# EAGLE design BOARD1A (EAGLE 7.4.0)
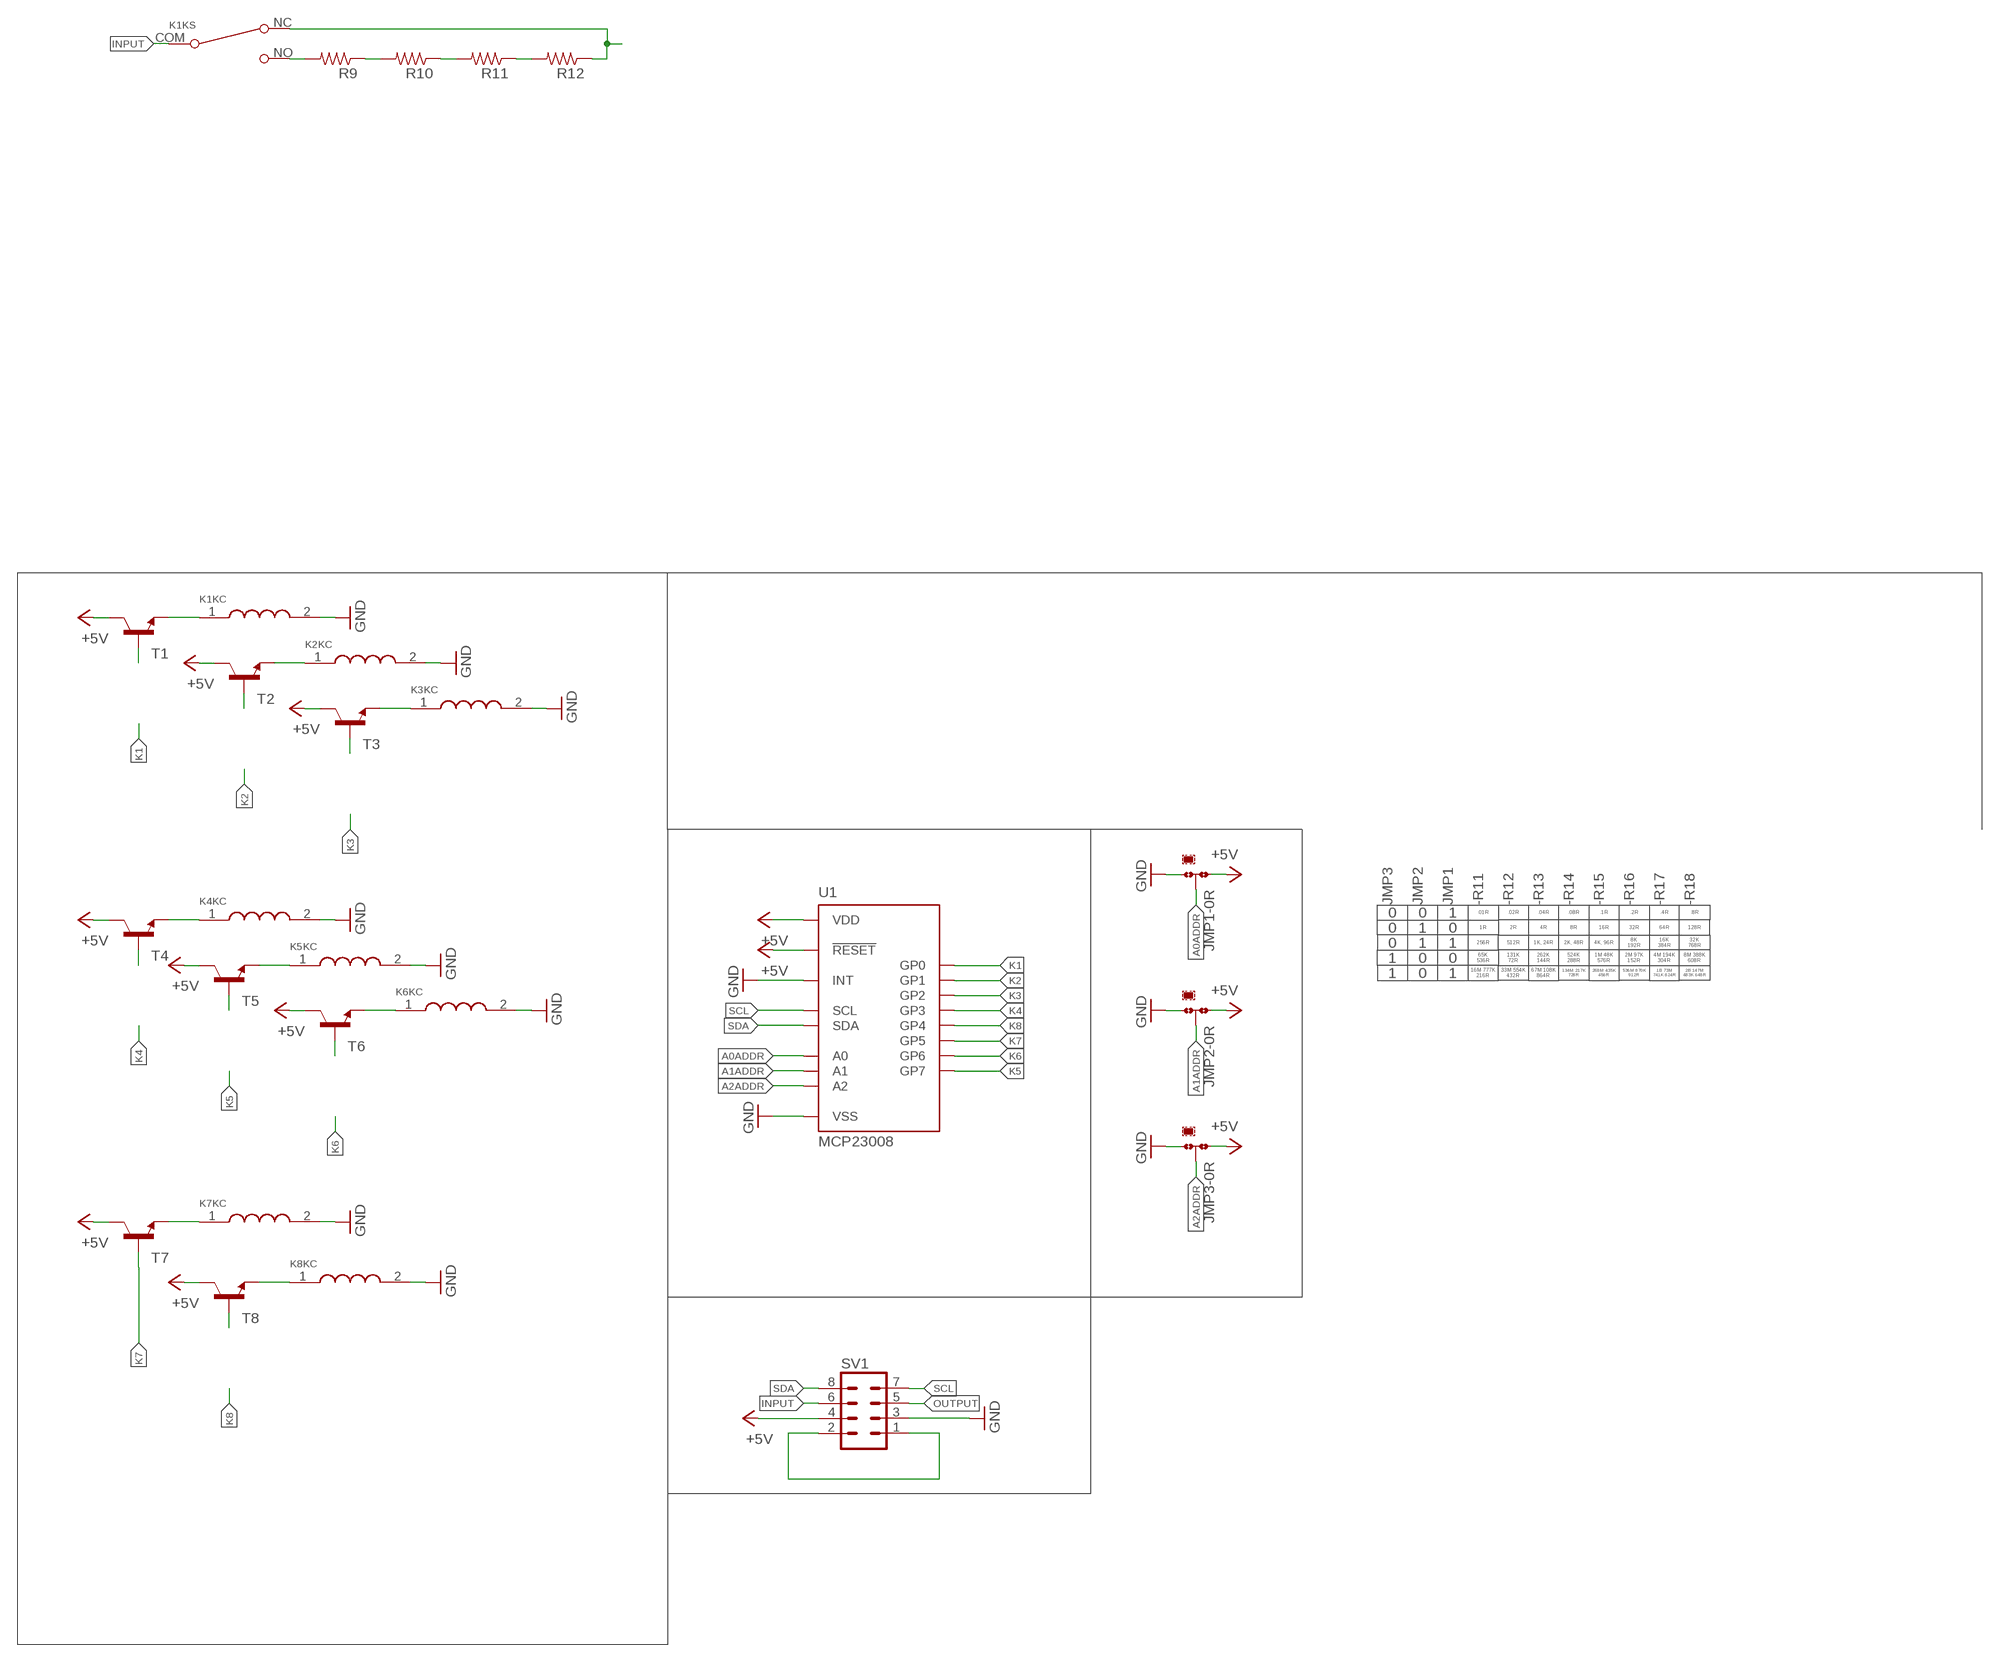
[diagram p0: schematic, sheet 1]

## Parts
JMP1  0R-JUMPA  [A0R-JMP]
JMP2  0R-JUMPA  [A0R-JMP]
JMP3  0R-JUMPA  [A0R-JMP]
K1  G5LE-1-VD DC12  G5LE  [G5LE]
K2  G5LE  [G5LE]
K3  G5LE  [G5LE]
K4  G5LE  [G5LE]
K5  G5LE  [G5LE]
K6  G5LE  [G5LE]
K7  G5LE  [G5LE]
K8  G5LE  [G5LE]
R9  R-US_0207/12  [0207/12]
R10  R-US_0207/12  [0207/12]
R11  R-US_0207/12  [0207/12]
R12  R-US_0207/12  [0207/12]
SV1  MA04-2  [MA04-2]
T1  MMUN2211LT1-NPN-SC59-BEC  [SC59-BEC]
T2  MMUN2211LT1-NPN-SC59-BEC  [SC59-BEC]
T3  MMUN2211LT1-NPN-SC59-BEC  [SC59-BEC]
T4  MMUN2211LT1-NPN-SC59-BEC  [SC59-BEC]
T5  MMUN2211LT1-NPN-SC59-BEC  [SC59-BEC]
T6  MMUN2211LT1-NPN-SC59-BEC  [SC59-BEC]
T7  MMUN2211LT1-NPN-SC59-BEC  [SC59-BEC]
T8  MMUN2211LT1-NPN-SC59-BEC  [SC59-BEC]
U1  MCP23008  [SOIC]

## Nets
+5V: JMP1.1 JMP2.1 JMP3.1 SV1.4 T1.C T2.C T3.C T4.C T5.C T6.C T7.C T8.C U1.P$6(!RESET) U1.P$18(VDD)
A0ADDR: JMP1.2 U1.P$5(A0)
A1ADDR: JMP2.2 U1.P$4(A1)
A2ADDR: JMP3.2 U1.P$3(A2)
GND: JMP1.3 JMP2.3 JMP3.3 K1.2(KC:COILB) K2.2(KC:COILB) K3.2(KC:COILB) K4.2(KC:COILB) K5.2(KC:COILB) K6.2(KC:COILB) K7.2(KC:COILB) K8.2(KC:COILB) SV1.3 U1.P$8(INT) U1.P$9(VSS)
INPUT: K1.COM(KS:P$COM) SV1.6
K1: U1.P$10(GP0)
K2: U1.P$11(GP1)
K3: U1.P$12(GP2)
K4: U1.P$13(GP3)
K5: U1.P$17(GP7)
K6: U1.P$16(GP6)
K7: U1.P$15(GP5)
K8: U1.P$14(GP4)
N$1: K1.NO(KS:P$NO) R9.2
N$2: R9.1 R10.2
N$3: R10.1 R11.2
N$4: R11.1 R12.2
N$5: SV1.1 SV1.2
N$6: K1.NC(KS:P$NC) R12.1
N$11: K1.1(KC:COILA) T1.E
N$12: T1.B
N$13: K2.1(KC:COILA) T2.E
N$14: T2.B
N$15: K3.1(KC:COILA) T3.E
N$16: T3.B
N$17: K4.1(KC:COILA) T4.E
N$18: T4.B
N$19: K5.1(KC:COILA) T5.E
N$20: T5.B
N$21: K6.1(KC:COILA) T6.E
N$22: T6.B
N$23: K7.1(KC:COILA) T7.E
N$24: T7.B
N$25: K8.1(KC:COILA) T8.E
N$26: T8.B
OUTPUT: SV1.5
SCL: SV1.7 U1.P$1(SCL)
SDA: SV1.8 U1.P$2(SDA)
Unconnected: K2.COM(KS:P$COM) K2.NC(KS:P$NC) K2.NO(KS:P$NO) K3.COM(KS:P$COM) K3.NC(KS:P$NC) K3.NO(KS:P$NO) K4.COM(KS:P$COM) K4.NC(KS:P$NC) K4.NO(KS:P$NO) K5.COM(KS:P$COM) K5.NC(KS:P$NC) K5.NO(KS:P$NO) K6.COM(KS:P$COM) K6.NC(KS:P$NC) K6.NO(KS:P$NO) K7.COM(KS:P$COM) K7.NC(KS:P$NC) K7.NO(KS:P$NO) K8.COM(KS:P$COM) K8.NC(KS:P$NC) K8.NO(KS:P$NO)

## Notes on the sheet
- JMP3 | JMP2 | JMP1 | -R11 | -R12 | -R13 | -R14 | -R15 | -R16 | -R17 | -R18
- 0 | 0 | 1 | .01R | .02R | .04R | .08R | .1R | .2R | .4R | .8R
- 0 | 1 | 0 | 1R | 2R | 4R | 8R | 16R | 32R | 64R | 128R
- 0 | 1 | 1 | 256R | 512R | 1K, 24R | 2K, 48R | 4K, 96R
- 8K
  192R
- 16K
  384R
- 32K
  768R
- 1 | 0 | 0
- 65K
  536R
- 131K
  72R
- 262K
  144R
- 524K
  288R
- 1M 48K
  576R
- 2M 97K
  152R
- 4M 194K
  304R
- 8M 388K
  608R
- 1 | 0 | 1
- 16M 777K
  216R
- 33M 554K
  432R
- 67M 108K
  864R
- 134M 217K
  728R
- 268M 435K
  456R
- 536M 870K
  912R
- 1B 73M
  741K 824R
- 2B 147M
  483K 648R

## Library data of the parts
JMP1-JMP3 = jump-0r-smd:0R-JUMP: SMD 0R 0805 Jumper
K1-K8 = Jeremy:G5LE; G5LE: -1
R9-R12 = resistor:R-US_: RESISTOR, American symbol
SV1 = con-lstb:MA04-2: PIN HEADER; OC_FARNELL: unknown; OC_NEWARK: unknown
T1-T8 = transistor-neu-to92:*-NPN-: NPN Transistror
U1 = Jeremy:MCP23008: MCP23008 8-Bit I/O Expander I2C Interface ADDR: S0100XXX

## Net classes
0 default: clearance 0.205 mm

## Board
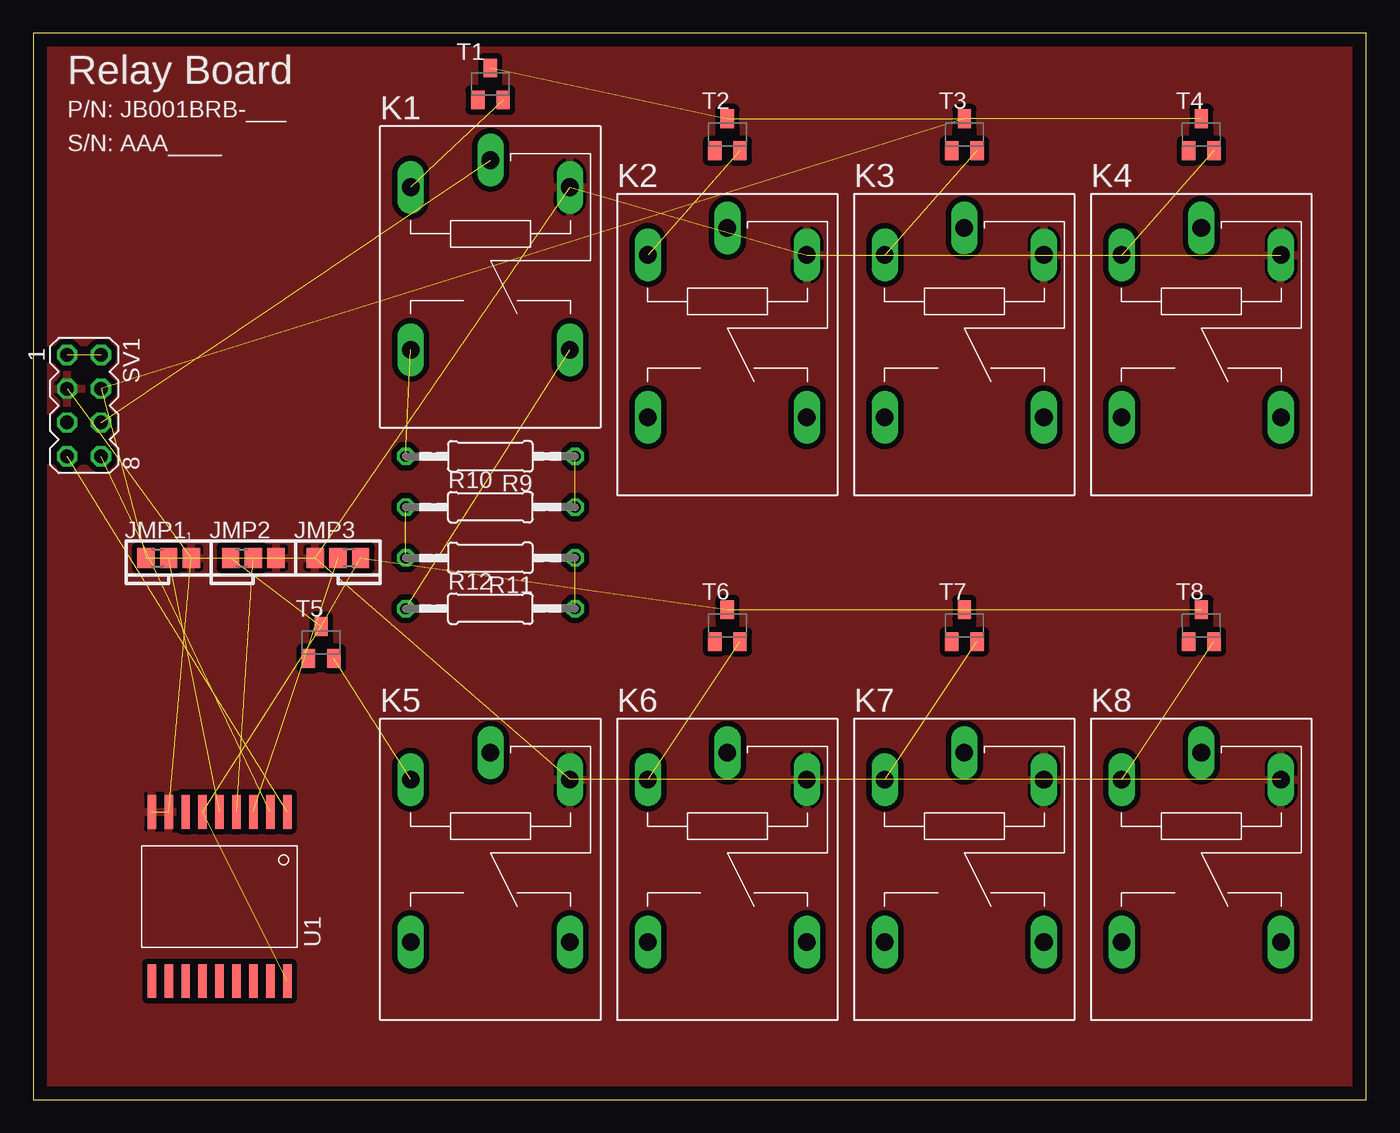
[diagram p1: board, top side]
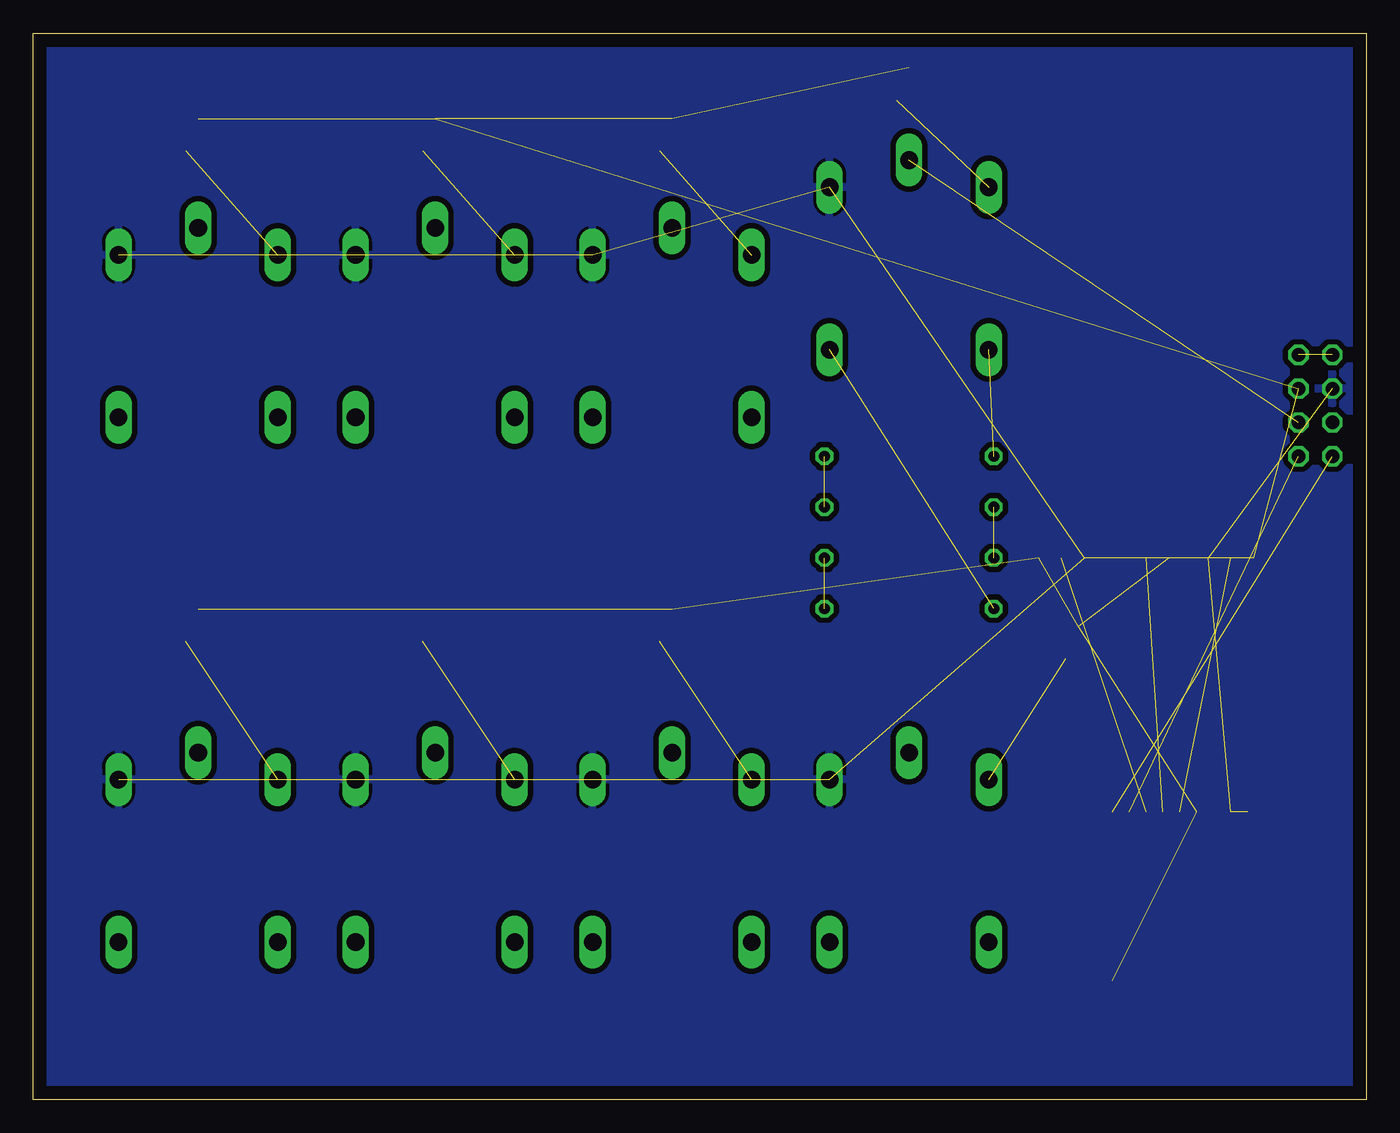
[diagram p2: board, bottom side, seen from below]

Size 100 x 80 mm. Coordinates in mm from the lower left corner, seen from the top.
Outline: 0,0 100,0 100,80 0,80 0,0
Copper layers (1*16): Top 0.035mm / dielectric 1.5mm / Bottom 0.035mm
Design rules "default": minimum track width 10mil, minimum drill 24mil, track to track 8mil, track to pad 8mil, pad to pad 8mil, via to via 8mil, smd to smd 8mil, copper to edge 40mil, drill to drill 8mil, minimum pad ring 10mil, minimum via ring 8mil, stop-mask expansion 4mil, vias tented up to drill 0mil, thermal gap 10mil

### Footprints (pad centres in the part's own frame; a part is rotated, then mirrored left to right if it is on the bottom)
A0R-JMP = smd 1.5 x 1.3: 1 0,1.7; 2 0,0; 3 0,-1.7
G5LE = drill 1.321 long: 1 -7.493,-5.969; 2 -7.493,5.969; COM -9.525,0; NC 4.699,5.969; NO 4.699,-5.969
0207/12 = drill 0.813 octagon: 1 -6.35,0; 2 6.35,0
MA04-2 = drill 1.016 octagon: 1 -3.81,-1.27; 2 -3.81,1.27; 3 -1.27,-1.27; 4 -1.27,1.27; 5 1.27,-1.27; 6 1.27,1.27; 7 3.81,-1.27; 8 3.81,1.27
SC59-BEC = smd 1 x 1.4: B -0.95,-1.2; C 0,1.2; E 0.95,-1.2
SOIC = smd 2.54 x 0.635: P$1 6.35,-5.08; P$2 6.35,-3.81; P$3 6.35,-2.54; P$4 6.35,-1.27; P$5 6.35,0; P$6 6.35,1.27; P$7 6.35,2.54; P$8 6.35,3.81; P$9 6.35,5.08; P$10 -6.35,5.08; P$11 -6.35,3.81; P$12 -6.35,2.54; P$13 -6.35,1.27; P$14 -6.35,0; P$15 -6.35,-1.27; P$16 -6.35,-2.54; P$17 -6.35,-3.81; P$18 -6.35,-5.08

### Placement (x,y rotation side)
JMP1  10.16,40.64 90 top
JMP2  16.51,40.64 90 top
JMP3  22.86,40.64 270 top
K1  34.29,60.96 270 top
K2  52.07,55.88 270 top
K3  69.85,55.88 270 top
K4  87.63,55.88 270 top
K5  34.29,16.51 270 top
K6  52.07,16.51 270 top
K7  69.85,16.51 270 top
K8  87.63,16.51 270 top
R9  34.29,48.26 180 top
R10  34.29,44.45 0 top
R11  34.29,40.64 180 top
R12  34.29,36.83 0 top
SV1  3.81,52.07 270 top
T1  34.29,76.2 0 top
T2  52.07,72.39 0 top
T3  69.85,72.39 0 top
T4  87.63,72.39 0 top
T5  21.59,34.29 0 top
T6  52.07,35.56 0 top
T7  69.85,35.56 0 top
T8  87.63,35.56 0 top
U1  13.97,15.24 90 top

### Tracks (layer width: path | path; a pad name or v marks a point on that pad's centre or on a via)
+5V  (13 unrouted)
A0ADDR  (1 unrouted)
A1ADDR  (1 unrouted)
A2ADDR  (1 unrouted)
GND  (13 unrouted)
  pour Bottom (isolate 0.406): 0,80.01 0,0 100.33,0 100.33,80.01
  pour Top (isolate 0.406): 0,80.01 0,0 100.33,0 100.33,80.01
INPUT  (1 unrouted)
N$1  (1 unrouted)
N$2  (1 unrouted)
N$3  (1 unrouted)
N$4  (1 unrouted)
N$5  (1 unrouted)
N$6  (1 unrouted)
N$11  (1 unrouted)
N$13  (1 unrouted)
N$15  (1 unrouted)
N$17  (1 unrouted)
N$19  (1 unrouted)
N$21  (1 unrouted)
N$23  (1 unrouted)
N$25  (1 unrouted)
SCL  (1 unrouted)
SDA  (1 unrouted)

### Text on the board
tPlace: 1
_tsilk: Relay Board | P/N: JB001BRB-___ | S/N: AAA____